# EasyEDA Pro project ProPrj_F411SoundBoard_2026-02-11.epro, board F411SoundBoard
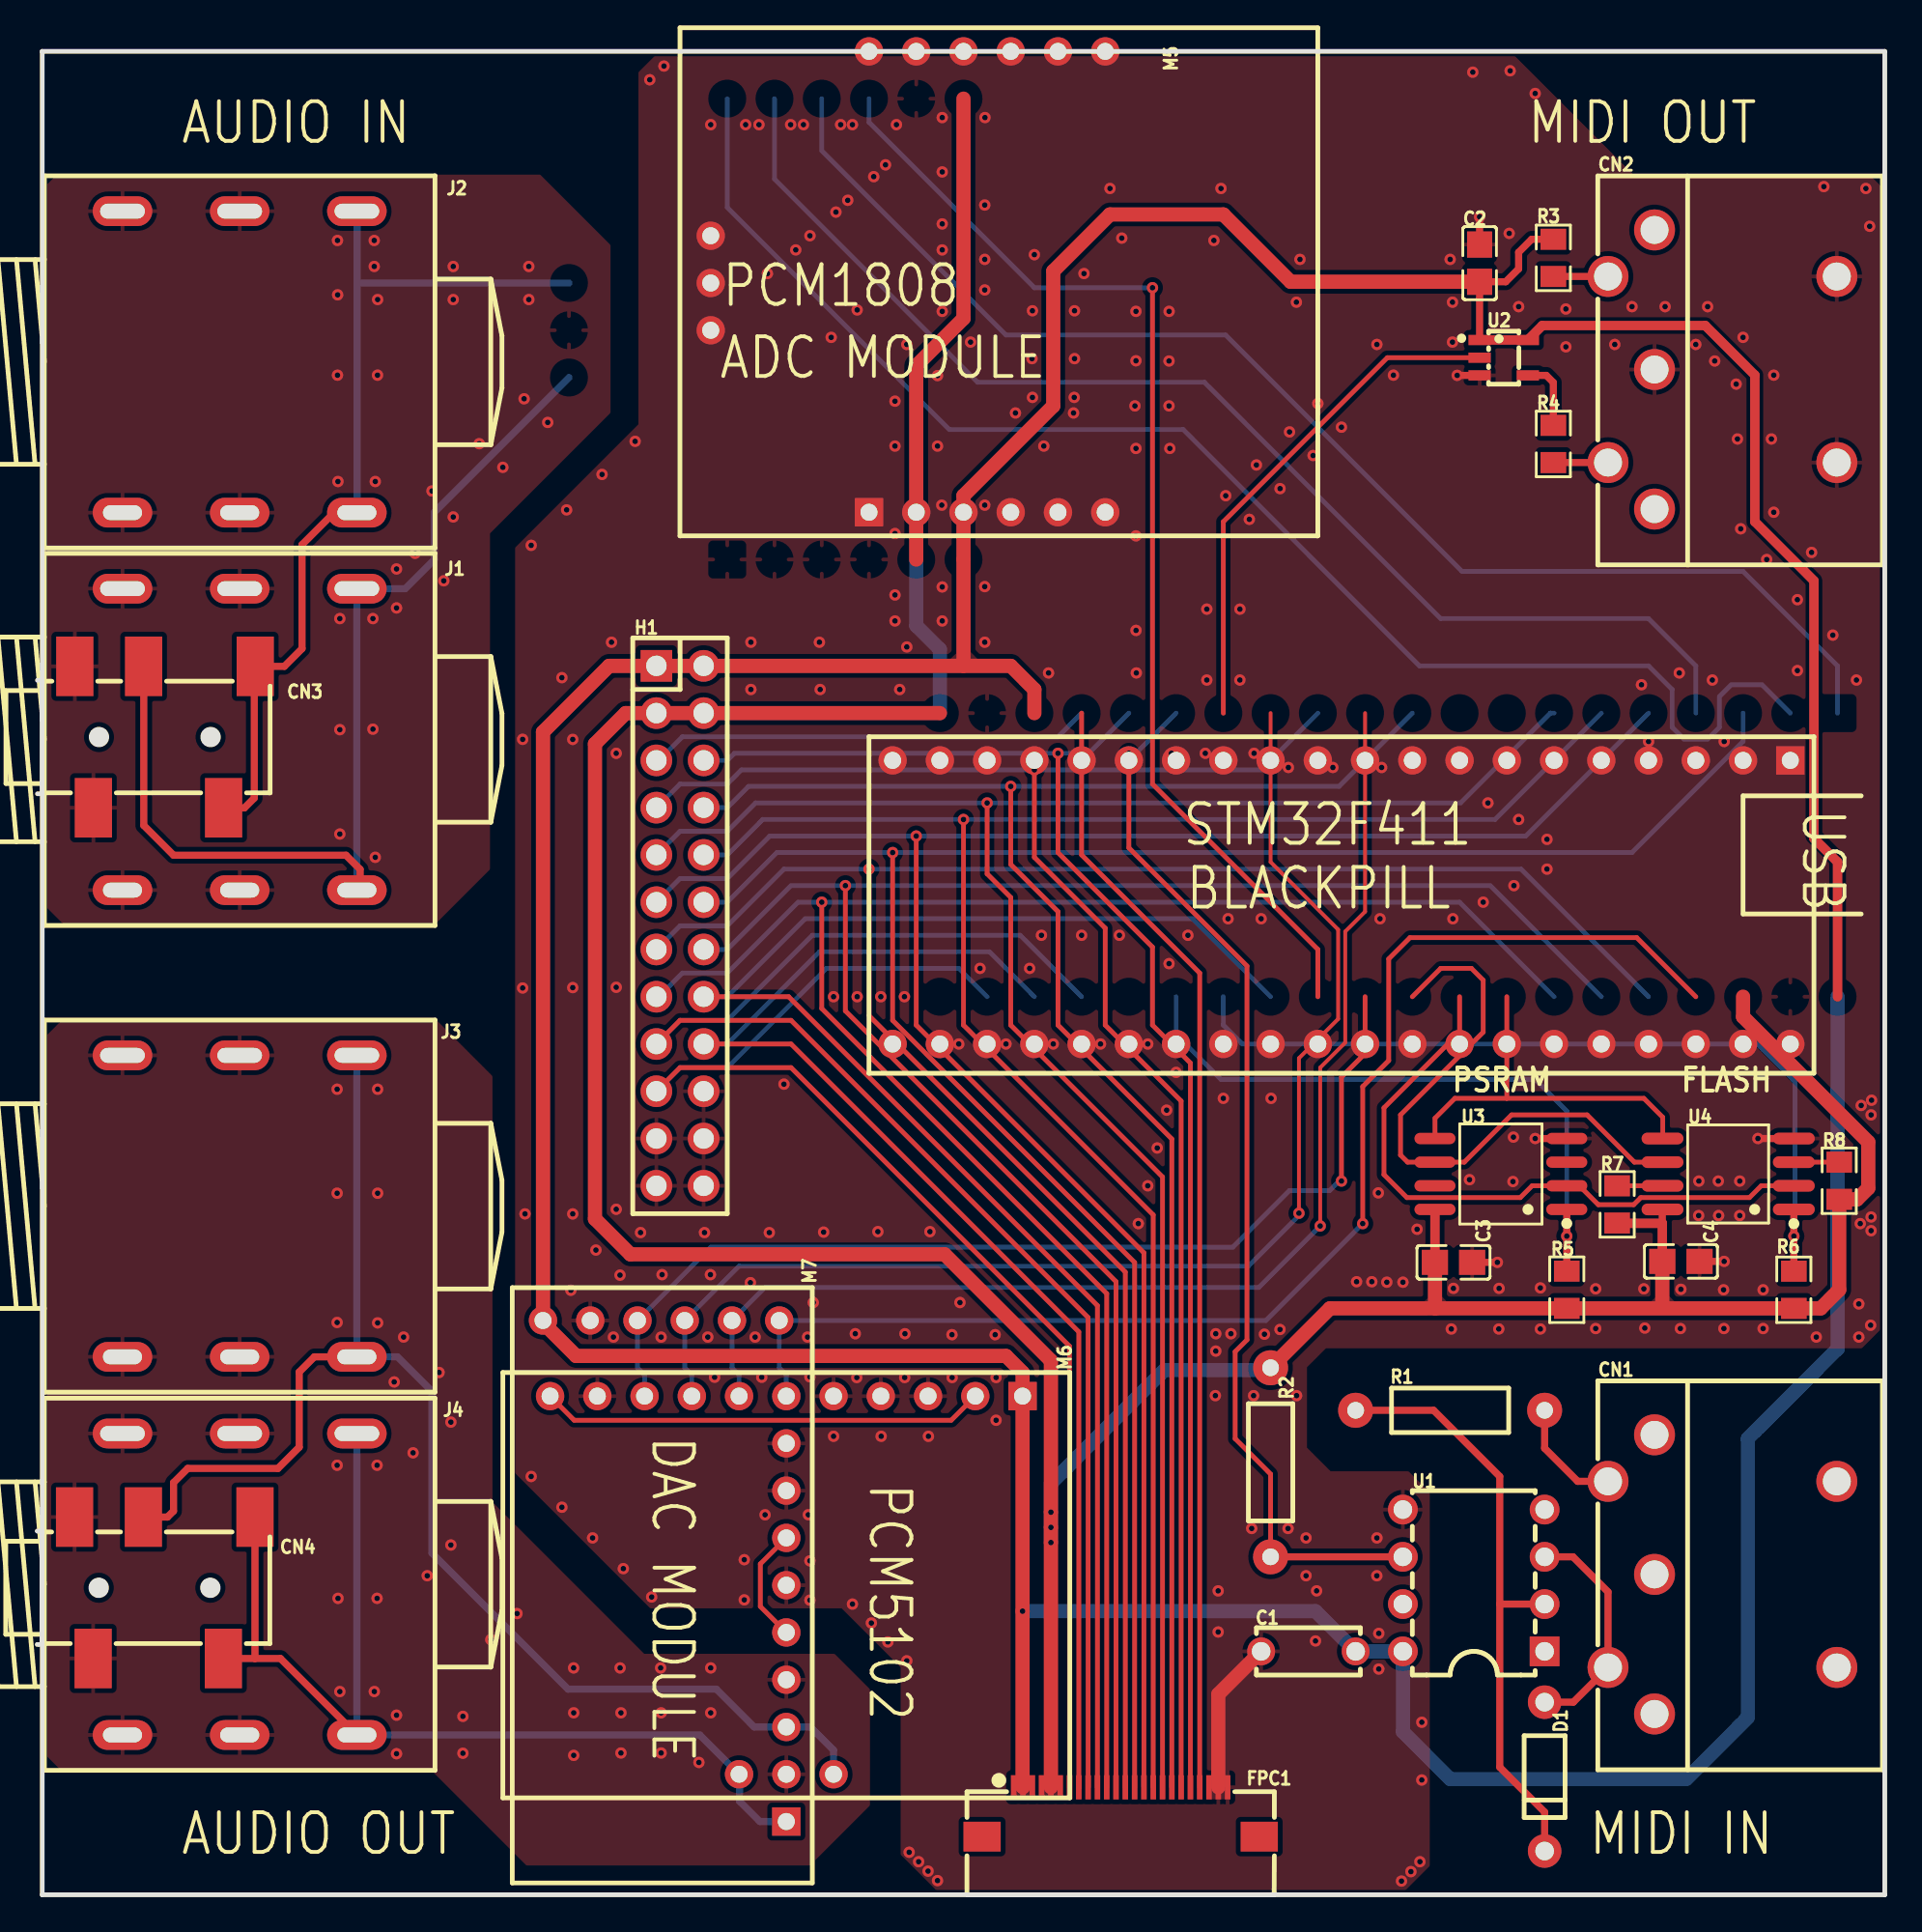
[diagram p2: board, top side]
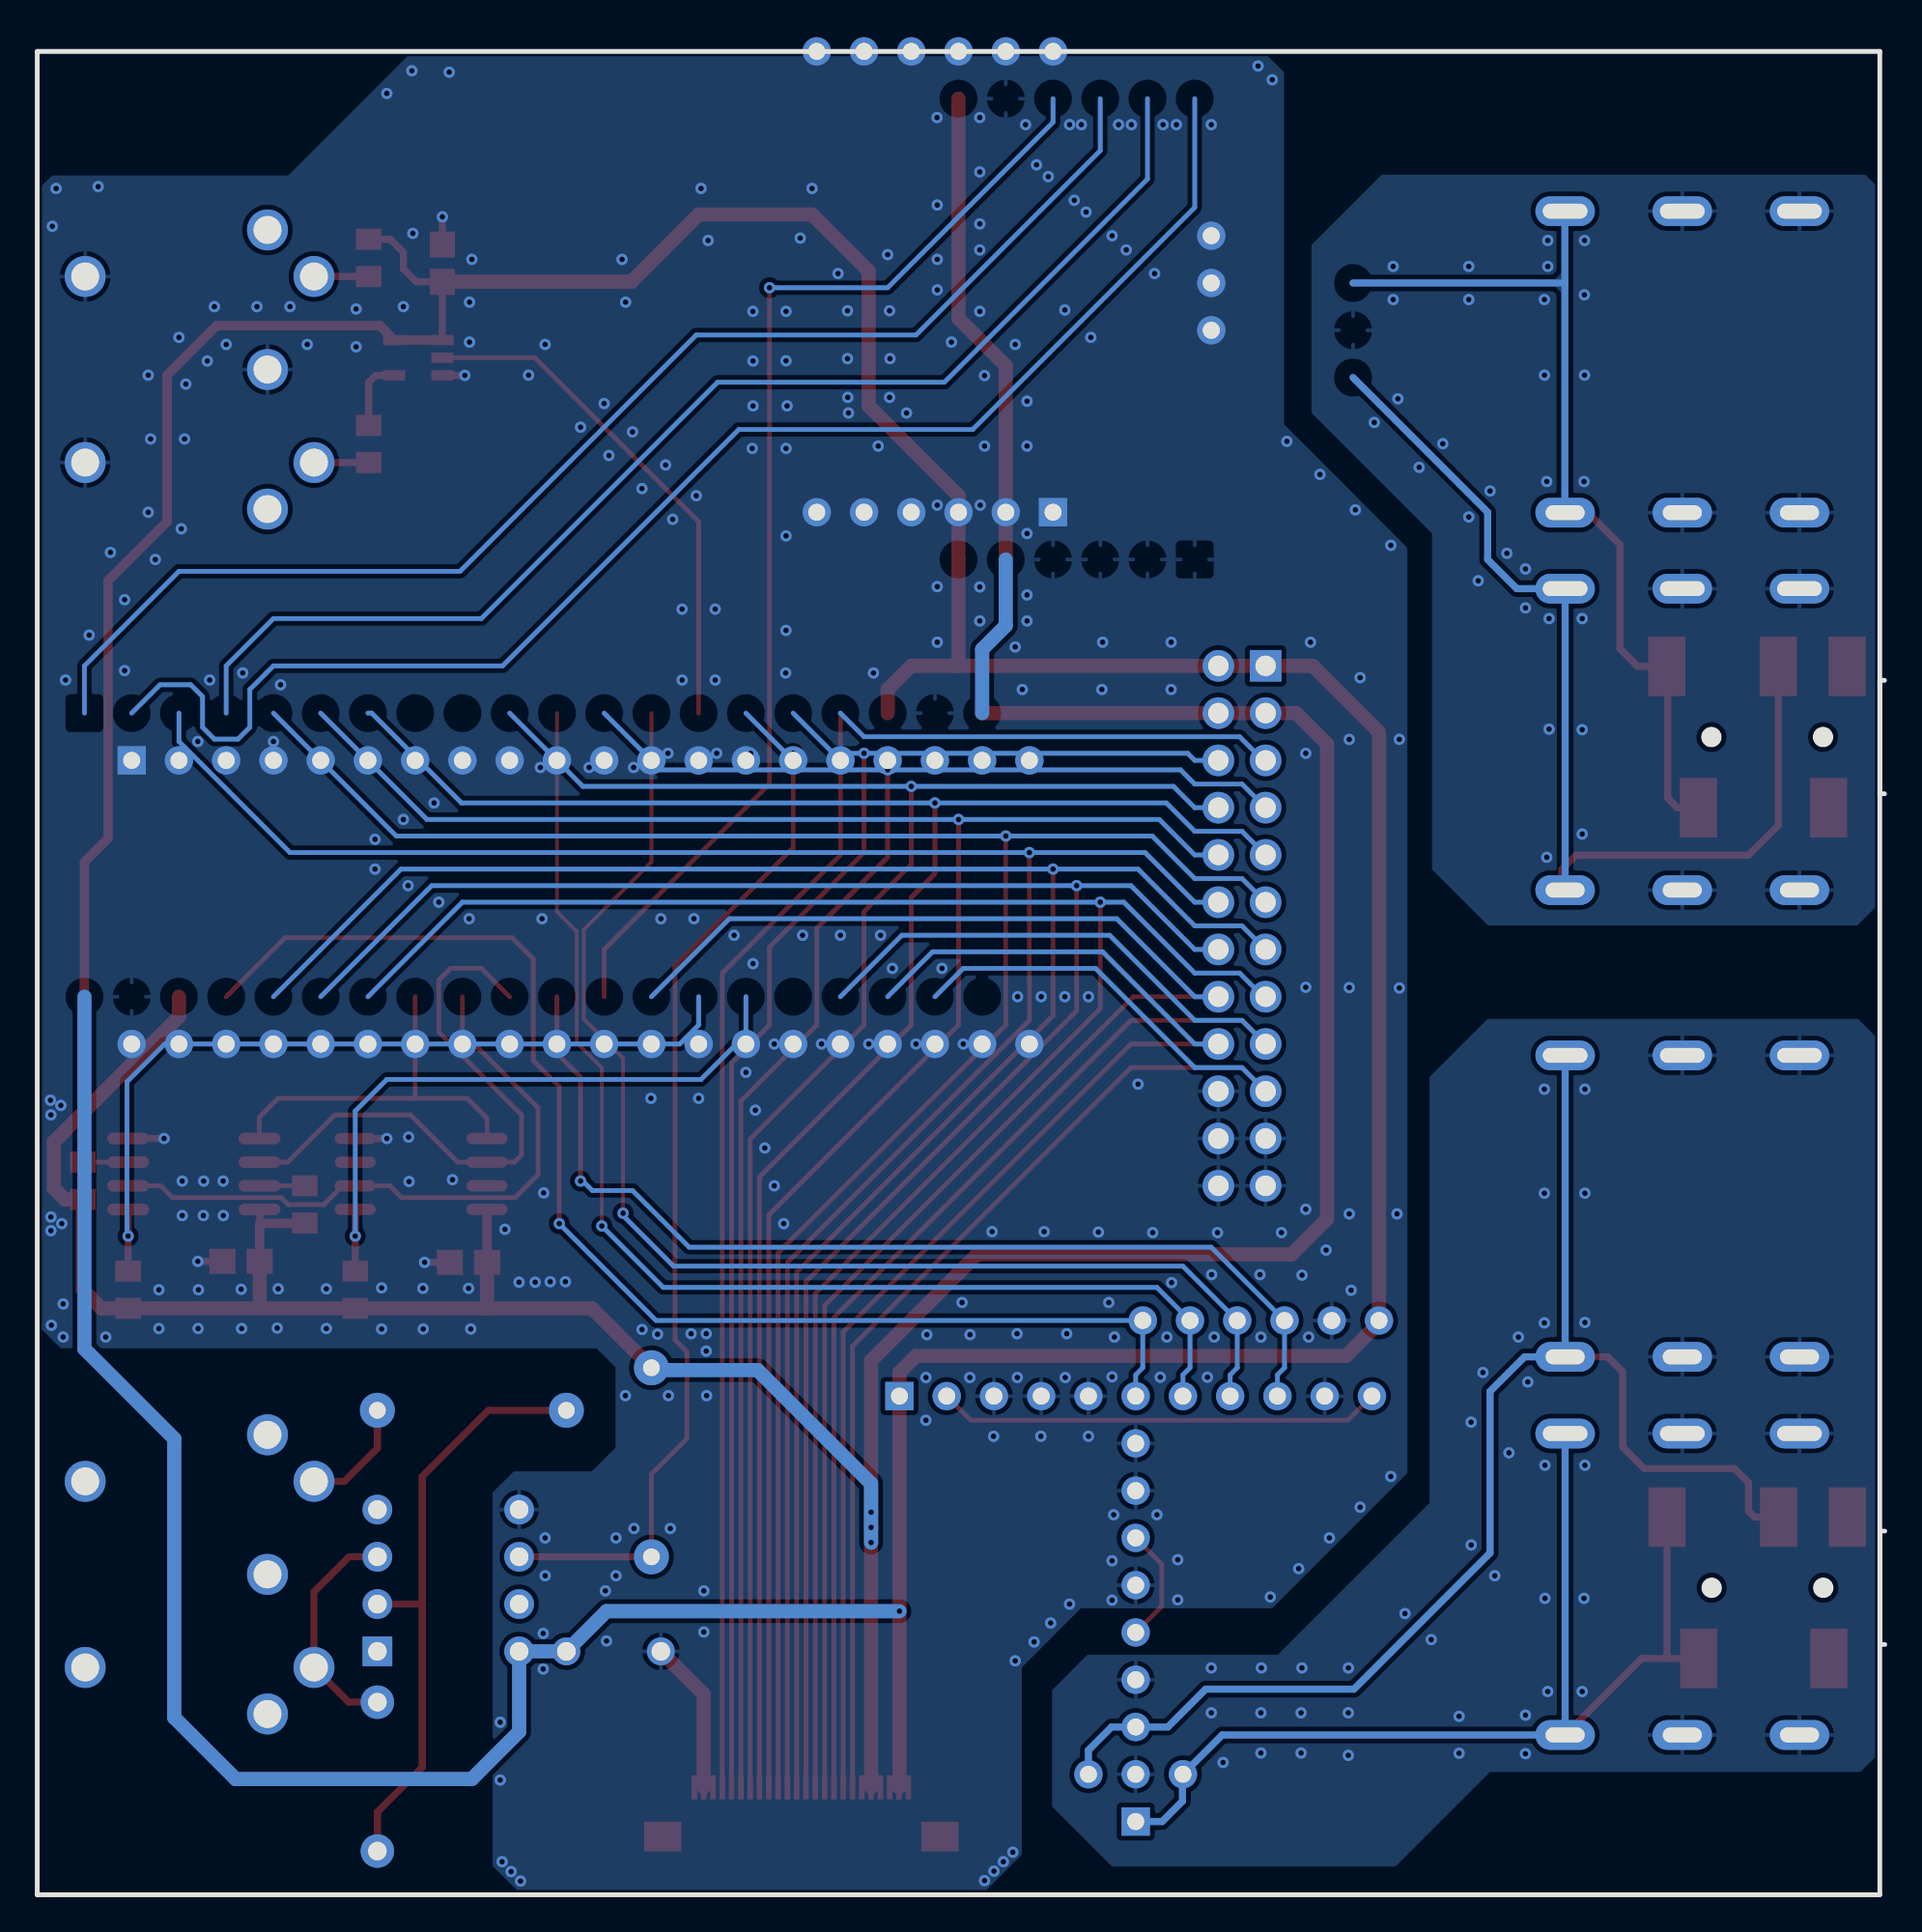
[diagram p3: board, bottom side, seen from below]

Outline 99.33 x 99.06 mm; copper layers: Top Layer, Bottom Layer. Coordinates in mm from the lower left corner of the outline.
Outline path: 0.27,99.06 99.33,99.06 99.33,0 0.27,0 0.27,99.06
Stack: Top Layer 0.035mm / Dielectric1 1.51mm FR4 er 4.5 / Bottom Layer 0.035mm

## Design rules (mm)
template: Custom Config
spacing copperThickness1oz (default): track to track 0.152, other pairs 0.152 to 0.3
spacing copperThickness2oz: track to track 0.203, other pairs 0.152 to 0.3
track width copperThickness1oz (default): min 0.127, default 0.254, max 2.54
track width copperThickness2oz: min 0.203, default 0.254, max 2.54
differential pair differentialPair (default): width min 0.127, default 0.254, max 2.54; gap min 0.152, default 0.152
via viaSize (default): diameter min 0.5, default 0.61, max 10; hole min 0.3, default 0.305, max 6.3

## Placement (name value [footprint] x y rotation side)
C1  100nF  [CAP-TH_L5.5-W2.4-P5.08-D0.6]  68.34 13.08 0 top
C2  100nF  [C0805]  77.54 87.68 90 top
C3  100nF  [C0805]  76.14 33.98 0 top
C4  100nF  [C0805]  88.37 34.04 0 top
CN1  DIN-504B-M10  [CONN-TH_DIN-504B-M10]  90.6 17.22 90 top
CN2  DIN-504B-M10  [CONN-TH_DIN-504B-M10]  90.6 81.97 90 top
CN3  PJ-327A 5JJ  [AUDIO-SMD_PJ-327A5JJ]  6.87 62.22 90 top
CN4  PJ-327A 5JJ  [AUDIO-SMD_PJ-327A5JJ]  6.86 16.5 90 top
D1  1N4148  [DO-35_BD2.0-L4.0-P8.00-D0.5-FD]  81.04 6.35 270 top
FPC1  AFC01-S24FCA-00  [FPC-SMD_24P-P0.50_AFC01-S24FCA-00]  58.25 4.45 0 top
H1  PZ254V-12-24P  [HDR-TH_24P-P2.54-V-M-R2-C12-S2.54]  34.56 52.07 270 top
J1  PJ-609  [AUDIO-TH_PJ-609]  10.89 62.09 0 top
J2  PJ-609  [AUDIO-TH_PJ-609]  10.89 82.37 0 top
J3  PJ-609  [AUDIO-TH_PJ-609]  10.89 37.01 0 top
J4  PJ-609  [AUDIO-TH_PJ-609]  10.89 16.69 0 top
M1  Blackpill F411  [Module_20x2_600mil]  96.79 63.5 270 top
M5  PCM1808  [PCM1808_ADC_MODULE]  37.1 71.75 90 top
M6  PCM5102  [WCMCU-5102]  52.97 26.8 270 top
M7  PCM5102  [PCM5102_MODULE]  40.27 3.94 180 top
R1  10kΩ  [R_AXIAL-0.4]  75.96 26.03 0 top
R2  10kΩ  [R_AXIAL-0.4]  66.31 23.24 90 top
R3  10kΩ  [R0805]  81.51 87.96 270 top
R4  10kΩ  [R0805]  81.51 77.96 270 top
R5  10kΩ  [R0805]  82.23 32.51 270 top
R6  10kΩ  [R0805]  94.44 32.51 270 top
R7  10kΩ  [R0805]  84.94 37.1 270 top
R8  10kΩ  [R0805]  96.88 38.37 270 top
U1  6N139  [DIP-8_L9.6-W6.4-P2.54-LS7.9-BL]  77.23 16.89 90 top
U2  74LVC1G126GV  [SOT-753_L3.1-W1.7-P0.95-LS3.0-BR]  78.84 82.6 180 top
U3  PSRAM 8MB  [SOP-8_L5.3-W5.2-P1.27-LS7.9-BL]  78.69 38.74 90 top
U4  W25Q128JVSIQ  [SOIC-8_L5.3-W5.3-P1.27-LS8.0-BL]  90.91 38.74 90 top

## Footprints (pads in the part's own frame, mm; a bottom-side part is the same pattern mirrored in y, then rotated)
AUDIO-SMD_PJ-327A5JJ
  rect 3.2x2 smd: 1(3.8,4.85) 2(-3.8,3.85) 3(3.8,1.15) 4(-3.8,-3.15) 5(3.8,-4.85)
AUDIO-TH_PJ-609
  oval 3.2x1.6 hole 2.1x0.8: 2(-6.3,-8.1) 4(0,-8.1) 6(6.3,-8.1)
  oval 3.2x1.6 hole 2.4x0.8: 3(-6.3,8.1) 5(0,8.1) 7(6.3,8.1)
C0805
  rect 1.41x1.35 smd: 1(-1,0) 2(1,0)
CAP-TH_L5.5-W2.4-P5.08-D0.6
  round 1.5 hole 1: 1(-2.54,0) 2(2.54,0)
CONN-TH_DIN-504B-M10
  round 2.2 hole 1.5: 1(-7.5,3.65) 2(-5,6.15) 3(0,3.65) 4(5,6.15) 5(7.5,3.65) 6(-5,-6.15) 7(5,-6.15)
DIP-8_L9.6-W6.4-P2.54-LS7.9-BL
  rect 1.6x1.6 hole 1: 1(-3.81,-3.81)
  round 1.6 hole 1: 2(-1.27,-3.81) 3(1.27,-3.81) 4(3.81,-3.81) 5(3.81,3.81) 6(1.27,3.81) 7(-1.27,3.81) 8(-3.81,3.81)
DO-35_BD2.0-L4.0-P8.00-D0.5-FD
  round 1.8 hole 1: 1(-4,0) 2(4,0)
FPC-SMD_24P-P0.50_AFC01-S24FCA-00
  rect 0.3x1.3 smd: 1(-5.75,1.325) 2(-5.25,1.325) 3(-4.75,1.325) 4(-4.25,1.325) 5(-3.75,1.325) 6(-3.25,1.325) 7(-2.75,1.325) 8(-2.25,1.325) 9(-1.75,1.325) 10(-1.25,1.325) 11(-0.75,1.325) 12(-0.25,1.325) 13(0.25,1.325) 14(0.75,1.325) 15(1.25,1.325) 16(1.75,1.325) 17(2.25,1.325) 18(2.75,1.325) 19(3.25,1.325) 20(3.75,1.325) 21(4.25,1.325) 22(4.75,1.325) 23(5.25,1.325) 24(5.75,1.325)
  rect 2x1.6 smd: 25(7.45,-1.325) 26(-7.45,-1.325)
HDR-TH_24P-P2.54-V-M-R2-C12-S2.54
  rect 1.7x1.7 hole 1.1: 1(-13.97,-1.27)
  round 1.7 hole 1.1: 2(-13.97,1.27) 3(-11.43,-1.27) 4(-11.43,1.27) 5(-8.89,-1.27) 6(-8.89,1.27) 7(-6.35,-1.27) 8(-6.35,1.27) 9(-3.81,-1.27) 10(-3.81,1.27) 11(-1.27,-1.27) 12(-1.27,1.27) 13(1.27,-1.27) 14(1.27,1.27) 15(3.81,-1.27) 16(3.81,1.27) 17(6.35,-1.27) 18(6.35,1.27) 19(8.89,-1.27) 20(8.89,1.27) 21(11.43,-1.27) 22(11.43,1.27) 23(13.97,-1.27) 24(13.97,1.27)
Module_20x2_600mil
  rect 1.524x1.524 hole 0.914: 1(2.54,-2.54)
  round 1.524 hole 0.914: 2(2.54,-5.08) 3(2.54,-7.62) 4(2.54,-10.16) 5(2.54,-12.7) 6(2.54,-15.24) 7(2.54,-17.78) 8(2.54,-20.32) 9(2.54,-22.86) 10(2.54,-25.4) 11(2.54,-27.94) 12(2.54,-30.48) 13(2.54,-33.02) 14(2.54,-35.56) 15(2.54,-38.1) 16(2.54,-40.64) 17(2.54,-43.18) 18(2.54,-45.72) 19(2.54,-48.26) 20(2.54,-50.8) 21(17.78,-50.8) 22(17.78,-48.26) 23(17.78,-45.72) 24(17.78,-43.18) 25(17.78,-40.64) 26(17.78,-38.1) 27(17.78,-35.56) 28(17.78,-33.02) 29(17.78,-30.48) 30(17.78,-27.94) 31(17.78,-25.4) 32(17.78,-22.86) 33(17.78,-20.32) 34(17.78,-17.78) 35(17.78,-15.24) 36(17.78,-12.7) 37(17.78,-10.16) 38(17.78,-7.62) 39(17.78,-5.08) 40(17.78,-2.54)
PCM1808_ADC_MODULE
  rect 1.524x1.524 hole 0.914: 1(2.54,-7.62)
  round 1.524 hole 0.914: 2(2.54,-10.16) 3(2.54,-12.7) 4(2.54,-15.24) 5(2.54,-17.78) 6(2.54,-20.32) 7(27.305,-20.32) 8(27.305,-17.78) 9(27.305,-15.24) 10(27.305,-12.7) 11(27.305,-10.16) 12(27.305,-7.62) 13(17.399,0.889) 14(14.859,0.889) 15(12.319,0.889)
PCM5102_MODULE
  rect 1.524x1.524 hole 0.914: 1(0,0)
  round 1.524 hole 0.914: 3(0,-5.08) 4(0,-7.62) 5(0,-10.16) 6(0,-12.7) 7(0,-15.24) 8(0,-17.78) 9(0,-20.32) 10(0.381,-26.924) 11(2.921,-26.924) 12(5.461,-26.924) 13(8.001,-26.924) 14(10.541,-26.924) 15(13.081,-26.924)
R0805
  rect 1.133x1.377 smd: 1(-1,0) 2(1,0)
R_AXIAL-0.4
  round 1.879 hole 0.899: 1(-5.08,0) 2(5.08,0)
SOIC-8_L5.3-W5.3-P1.27-LS8.0-BL
  oval 0.63x2.25 smd: 1(-1.905,-3.53) 2(-0.635,-3.53) 3(0.635,-3.53) 4(1.905,-3.53) 5(1.905,3.53) 6(0.635,3.53) 7(-0.635,3.53) 8(-1.905,3.53)
SOP-8_L5.3-W5.2-P1.27-LS7.9-BL
  oval 0.609x2.204 smd: 1(-1.905,-3.542) 2(-0.635,-3.542) 3(0.635,-3.542) 4(1.905,-3.542) 5(1.905,3.542) 6(0.635,3.542) 7(-0.635,3.542) 8(-1.905,3.542)
SOT-753_L3.1-W1.7-P0.95-LS3.0-BR
  rect 1.199x0.551 smd: 1(1.296,-0.95) 2(1.296,0) 3(1.296,0.95) 4(-1.296,0.95) 5(-1.296,-0.95)
WCMCU-5102
  rect 1.524x1.524 hole 0.914: 1(0,0)
  round 1.524 hole 0.914: 2(0,-2.54) 3(0,-5.08) 4(0,-7.62) 5(0,-10.16) 6(0,-12.7) 7(0,-15.24) 8(0,-17.78) 9(0,-20.32) 10(0,-22.86) 11(0,-25.4) 12(20.32,-15.24) 13(20.32,-12.7) 14(20.32,-10.16)

## Nets
As in the schematic.

Pads without a net: CN1 1 3 5 6 7; CN2 1 5; FPC1 25 26; M1 8 9 21 25; U1 1 4 7; U3 3 7

## Via types
v1: diameter 0.61, hole 0.305, Top Layer to Bottom Layer, 397 vias

## Routing (per net, layer and track width the routed paths; a pad name or vN(x,y) marks a point on that pad's centre or on a via; arc(x,y) is an arc through that point)
3V3: length 212.5
  Top Layer w0.381: 87.37,36.83 87.37,36.08
  Top Layer w0.508: U3.8 75.15,33.99 C3.1 ; 87.37,34.04 87.37,36.08 87.36,36.09 84.94,36.09
  Top Layer w0.762: 75.16,31.51 75.15,31.53 75.15,33.98 C3.1 ; 75.16,31.51 R5.2 R6.2 95.88,31.51 96.88,32.51 R8.2 97.84,37.37 98.44,37.97 98.44,40.45 91.71,47.18 91.71,48.26 ; 75.16,31.51 69.5,31.51 66.31,28.32 ; 48.53,63.5 H1.4 H1.3 31.64,63.5 29.99,61.85 29.99,36.32 31.89,34.42 48.78,34.42 54.5,28.7 v1(54.5,20.56) v1(54.5,19.74) v1(54.5,18.93) 54.5,5.78 ; 87.37,34.04 87.37,31.63 87.37,31.62 ; 47.26,71.75 47.26,82.17 49.8,84.71 49.8,96.52
  Bottom Layer w0.762: 54.5,18.92 v1(54.5,19.74) v1(54.5,20.56) 54.5,22.1 60.59,28.19 66.18,28.19 66.31,28.32 ; 48.53,63.5 48.53,66.93 47.26,68.2 47.26,71.75
+5V: length 306.9
  Top Layer w0.381: 77.54,83.55 C2.1 78.95,86.68 79.64,87.38 79.64,88.27 80.34,88.96 R3.1
  Top Layer w0.508: U2.1 U2.5 80.91,84.33 89.68,84.33 92.34,81.66 92.34,73.79 95.52,70.61 95.52,56.77 96.79,55.5 96.79,48.26
  Top Layer w0.762: FPC1.2 52.97,5.8 v1(52.97,15.24) M6.1 52.97,28.07 52.08,28.96 28.97,28.96 27.19,30.73 27.19,62.48 30.75,66.04 H1.1 H1.2 49.8,66.04 ; C2.1 67.38,86.68 63.77,90.3 57.67,90.3 54.62,87.25 54.62,80.01 49.8,75.18 49.8,66.04 ; 49.8,66.04 52.34,66.04 53.61,64.77 53.61,63.5
  Bottom Layer w0.762: v1(52.97,15.24) 68.72,15.24 C1.2 U1.8 73.42,8.76 75.96,6.22 88.66,6.22 91.96,9.53 91.96,24.51 96.79,29.34 96.79,48.26
GND: length 17.3
  Top Layer w0.381: C2.2 v1(77.54,90.17) ; U3.4 v1(80.53,40.64) ; C3.2 v1(78.5,33.98) ; U2.3 v1(76.34,81.65) ; C4.2 v1(90.69,34.04) ; U4.4 v1(92.51,40.64)
  Top Layer w0.762: C1.1 63.5,10.78 FPC1.23
  vias: v1(26.1,62.09) v1(26.1,48.73) v1(26.22,36.59) v1(26.56,72.52) v1(26.56,22.48) v1(28.21,65.41) v1(28.21,20.83) v1(28.46,74.42) v1(28.69,32.49) v1(28.79,62.09) v1(28.79,48.75) v1(28.79,36.59) v1(29.86,19.18) v1(30.04,34.65) v1(30.37,76.33) v1(30.88,67.31) v1(30.98,29.97) v1(31.13,61.34) v1(31.13,48.77) v1(31.13,36.84) v1(31.33,33.3) v1(31.51,17.53) v1(32.15,78.11) v1(32.44,35.59) v1(32.93,97.54) v1(33.03,16) v1(33.59,33.33) v1(33.54,29.97) v1(33.69,98.27) v1(35.87,35.59) v1(36.05,29.97) v1(36.21,95.12) v1(36.19,33.33) v1(36.42,27.81) v1(38.01,18.01) v1(38.01,15.85) v1(38.09,95.12) v1(38.37,67.31) v1(38.37,64.77) v1(38.34,32.89) v1(38.6,29.97) v1(38.8,95.12) v1(38.95,27.81) v1(39.13,20.42) v1(39.26,87.12) v1(39.36,35.59) v1(40.15,43.56) v1(40.5,95.12) v1(40.78,88.39) v1(41.2,95.12) v1(41.42,29.97) v1(41.46,20.42) v1(41.54,89.15) v1(41.54,27.83) v1(41.54,17.95) v1(41.54,15.83) v1(41.72,31.83) v1(42.05,67.31) v1(42.09,64.77) v1(42.28,35.61) v1(42.69,83.69) v1(42.81,48.26) v1(42.81,24.64) v1(42.94,90.42) v1(43.19,95.12) v1(43.57,91.06) v1(43.83,95.12) v1(43.83,15.62) v1(43.98,30.15) v1(44.08,85.17) v1(44.08,48.26) v1(44.06,27.8) v1(44.84,14.6) v1(44.97,92.33) v1(45.2,35.64) v1(45.35,48.26) v1(45.37,24.64) v1(45.61,92.96) v1(45.73,13.59) v1(46.12,80.26) v1(46.12,77.85) v1(46.12,73.15) v1(46.12,69.85) v1(46.12,68.45) v1(46.19,95.12) v1(46.37,64.77) v1(46.62,48.26) v1(46.65,30.15) v1(46.64,27.8) v1(46.75,83.31) v1(46.75,67.06) v1(46.75,12.57) v1(46.88,2.29) v1(47.38,1.78) v1(47.91,24.64) v1(47.89,1.27) v1(47.99,35.64) v1(48.4,81.64) v1(48.4,77.85) v1(48.4,0.76) v1(48.66,95.5) v1(48.66,92.58) v1(48.66,89.79) v1(48.66,88.39) v1(48.66,85.09) v1(48.63,74.68) v1(48.66,70.28) v1(48.66,68.45) v1(49.18,30.1) v1(49.19,27.8) v1(49.54,45.72) v1(49.61,31.83) v1(50.18,83.44) v1(50.69,49.78) v1(50.95,95.5) v1(50.94,90.81) v1(50.94,87.88) v1(50.94,86.24) v1(50.94,74.68) v1(50.94,70.3) v1(50.94,67.31) v1(51.5,30.1) v1(51.55,27.8) v1(51.55,25.5) v1(52.08,45.72) v1(52.59,79.63) v1(53.35,49.78) v1(53.51,85.12) v1(53.48,82.55) v1(53.51,80.47) v1(53.61,88.14) v1(53.99,51.56) v1(54.12,77.85) v1(54.37,65.66) v1(54.62,45.72) v1(55.71,79.63) v1(55.77,85.12) v1(55.77,82.55) v1(55.75,80.47) v1(56.15,51.56) v1(56.28,87.12) v1(57.16,45.72) v1(57.67,91.69) v1(58.18,51.56) v1(58.31,89.03) v1(59.01,80.01) v1(59.07,85.09) v1(59.07,82.44) v1(59.07,77.72) v1(59.07,73.03) v1(59.07,67.95) v1(59.09,65.66) v1(59.2,36.07) v1(59.7,45.72) v1(59.7,38.1) v1(60.21,40.13) v1(60.72,42.16) v1(60.85,85.09) v1(60.85,82.42) v1(60.85,80.01) v1(60.89,77.72) v1(60.85,50.04) v1(60.97,61.34) v1(61.23,44.2) v1(61.86,51.56) v1(62.8,61.34) v1(62.88,69.09) v1(62.88,65.28) v1(63.26,88.9) v1(63.36,30.15) v1(63.36,29.22) v1(63.34,26.82) v1(63.49,16.33) v1(63.49,14.12) v1(63.64,91.69) v1(63.77,42.8) v1(63.9,75.18) v1(64.02,52.45) v1(64.17,30.15) v1(64.66,69.09) v1(64.66,65.28) v1(65.16,73.91) v1(65.29,19.69) v1(65.4,26.82) v1(65.42,61.34) v1(65.55,76.84) v1(65.8,52.45) v1(65.98,30.12) v1(66.33,42.8) v1(66.82,75.56) v1(66.81,30.38) v1(67.26,60.58) v1(67.25,19.69) v1(67.32,78.61) v1(67.69,85.58) v1(67.71,26.82) v1(67.89,87.88) v1(68.21,19.18) v1(68.21,17.15) v1(68.59,77.34) v1(68.78,16.33) v1(68.72,13.64) v1(68.85,80.14) v1(69.66,60.58) v1(70.12,78.87) v1(70.93,32.94) v1(71.75,32.94) v1(72.02,83.31) v1(72.1,37.72) v1(72.02,19.18) v1(72.02,17.15) v1(72.19,52.45) v1(72.12,14.05) v1(72.12,12.13) v1(72.28,60.58) v1(72.56,32.92) v1(72.91,81.66) v1(73.34,0.74) v1(73.42,32.92) v1(73.85,1.24) v1(74.18,35.76) v1(74.33,1.78) v1(74.44,9.27) v1(74.44,6.17) v1(75.96,87.88) v1(76.09,85.58) v1(76.09,83.44) v1(76.11,52.45) v1(76.02,30.4) v1(76.14,32.59) v1(77,38.43) v1(77.18,97.94) v1(77.74,53.34) v1(77.99,58.67) v1(78.59,32.59) v1(78.58,30.4) v1(79.19,98.02) v1(79.13,89.28) v1(79.39,54.23) v1(79.36,40.72) v1(79.34,38.33) v1(79.64,85.34) v1(79.64,57.78) v1(80.53,96.8) v1(80.81,32.61) v1(80.81,30.4) v1(81.17,56.72) v1(81.17,55.12) v1(82.18,85.22) v1(82.18,83.19) v1(83.78,32.56) v1(83.78,30.43) v1(84.81,83.31) v1(85.74,85.34) v1(86.25,65.02) v1(86.37,32.56) v1(86.43,30.45) v1(86.63,61.98) v1(87.52,85.34) v1(88.28,65.66) v1(88.36,32.54) v1(88.34,30.43) v1(89.17,83.31) v1(89.33,38.35) v1(89.32,36.5) v1(89.8,85.34) v1(90.06,65.28) v1(90.18,82.42) v1(90.38,38.35) v1(90.39,36.5) v1(90.69,61.98) v1(90.66,32.51) v1(90.68,30.43) v1(91.34,81.18) v1(91.41,78.23) v1(91.58,73.41) v1(91.53,38.35) v1(91.53,36.5) v1(91.71,83.69) v1(92.79,32.51) v1(92.79,30.43) v1(92.98,71.75) v1(93.23,78.23) v1(93.36,81.66) v1(93.36,74.3) v1(94.63,69.6) v1(94.63,65.79) v1(95.39,72.14) v1(95.65,29.97) v1(96.05,91.8) v1(96.53,67.69) v1(97.8,65.28) v1(98.01,36.07) v1(97.93,31.75) v1(97.93,29.97) v1(98.06,42.42) v1(98.31,91.69) v1(98.52,89.66) v1(98.62,42.7) v1(98.59,41.91) v1(98.59,36.42) v1(98.59,35.69) v1(98.57,30.61)
AIGND:
  vias: v1(16.14,88.9) v1(16.15,85.98) v1(16.14,81.66) v1(16.17,75.95) v1(16.27,68.58) v1(16.27,62.61) v1(16.27,57) v1(18.05,68.58) v1(18.05,62.64) v1(18.12,88.9) v1(18.12,87.5) v1(18.17,75.95) v1(18.17,55.75) v1(18.3,85.73) v1(18.3,81.66) v1(19.32,71.25) v1(19.32,69.15) v1(20.32,72.09) v1(21.22,75.44) v1(21.86,70.61) v1(22.37,87.5) v1(22.37,85.73) v1(22.37,74.04) v1(23.76,77.98) v1(25.03,76.71) v1(26.18,80.39) v1(26.43,87.5) v1(26.43,85.73) v1(27.45,79.12)
AOGND:
  vias: v1(16.12,43.29) v1(16.12,37.7) v1(16.12,30.75) v1(16.12,23.08) v1(16.17,15.93) v1(16.27,10.92) v1(18.12,10.92) v1(18.3,43.29) v1(18.3,37.7) v1(18.3,30.73) v1(18.27,23.08) v1(18.27,15.93) v1(19.19,27.56) v1(19.32,9.65) v1(19.32,7.58) v1(19.7,29.97) v1(20.21,23.75) v1(20.97,17.15) v1(21.6,28.07) v1(22.24,25.4) v1(22.24,18.8) v1(22.89,9.59) v1(22.89,7.6) v1(24.39,13.71) v1(25.8,15.11) v1(28.84,12.19) v1(28.84,9.78) v1(28.84,7.49) v1(31.34,12.19) v1(31.38,9.78) v1(31.38,7.62) v1(33.52,12.19) v1(33.54,9.78) v1(33.54,7.62) v1(35.57,7.11) v1(36.21,12.19) v1(36.21,9.78)
AOL: length 58.5
  Top Layer w0.381: 11.7,12.7 CN4.4 ; 11.7,12.7 13.08,12.7 J4.6 ; 11.7,12.7 11.71,12.7 CN4.5
  Bottom Layer w0.381: J4.7 J4.6 35.62,8.59 M6.12 37.76,6.45 37.76,5.03 38.85,3.94 M7.1
AOR: length 75.3
  Top Layer w0.381: CN4.3 7,20.3 7.33,20.62 7.33,22.15 8.09,22.91 12.94,22.91 14.09,24.05 14.09,28.09 14.9,28.91 J3.6
  Bottom Layer w0.381: J3.7 J3.6 19.37,28.91 21.22,27.05 21.22,18.36 28.54,11.05 36.51,11.05 38.55,9.02 41.57,9.02 42.81,7.77 42.81,6.48
FLASH_CE: length 45.1
  Top Layer w0.381: U4.1 v1(94.44,35.39) R6.1
  Bottom Layer w0.254: 94.46,35.39 94.5,35.43 94.5,43.69 92.47,45.72 64.78,45.72 63.77,46.74 63.77,48.26
GPIO1: length 84.3
  Top Layer w0.254: 56.15,63.5 56.15,55.88 62.5,49.53 FPC1.21
  Bottom Layer w0.254: H1.5 33.41,60.96 34.69,62.23 54.88,62.23 56.15,63.5
GPIO2: length 82.4
  Top Layer w0.254: FPC1.20 62,44.7 59.96,46.74 59.96,50.93 54.88,56.01 v1(54.88,61.34)
  Bottom Layer w0.254: H1.6 37.1,60.96 37.48,61.34 v1(54.88,61.34) 56.53,61.34 58.69,63.5
GPIO3: length 95.6
  Top Layer w0.254: v1(53.61,60.45) 53.61,55.75 57.42,51.94 57.42,46.74 61.5,42.66 FPC1.19
  Bottom Layer w0.254: 68.85,63.5 65.8,60.45 v1(53.61,60.45) 37.86,60.45 37.1,59.69 34.56,59.69 H1.7
GPIO4: length 97.6
  Top Layer w0.254: v1(52.34,59.56) 52.34,55.37 54.88,52.83 54.88,46.74 61,40.62 FPC1.18
  Bottom Layer w0.254: 73.93,63.5 69.99,59.56 v1(52.34,59.56) 38.24,59.56 37.1,58.42 H1.8
GPIO5: length 108.2
  Top Layer w0.254: FPC1.17 60.5,38.58 52.34,46.74 52.34,53.59 51.07,54.86 v1(51.07,58.67)
  Bottom Layer w0.254: 81.55,63.5 81.34,63.5 76.52,58.67 v1(51.07,58.67) 38.62,58.67 37.1,57.15 34.56,57.15 H1.9
GPIO6: length 107.7
  Top Layer w0.254: FPC1.16 60,36.54 49.8,46.74 v1(49.8,57.78)
  Bottom Layer w0.254: 84.09,63.5 78.37,57.78 v1(49.8,57.78) 39,57.78 37.1,55.88 H1.10
GPIO7: length 113.7
  Top Layer w0.254: v1(47.26,56.9) 47.26,46.74 59.5,34.5 FPC1.15
  Bottom Layer w0.254: H1.11 34.56,54.61 37.1,54.61 39.38,56.9 v1(47.26,56.9) 80.02,56.9 86.63,63.5
GPIO8: length 116.6
  Top Layer w0.254: v1(45.99,56.01) 45.99,46.99 59,33.98 FPC1.14
  Bottom Layer w0.254: 91.71,63.5 91.71,61.98 85.74,56.01 v1(45.99,56.01) 39.77,56.01 37.1,53.34 H1.12
GPIO9: length 113
  Top Layer w0.254: FPC1.13 58.5,33.46 44.72,47.24 v1(44.72,55.12)
  Bottom Layer w0.254: 86.63,48.26 79.77,55.12 v1(44.72,55.12) 40.15,55.12 37.1,52.07 34.56,52.07 H1.13
GPIO10: length 106.6
  Top Layer w0.254: FPC1.12 58,32.95 43.45,47.5 v1(43.45,54.23)
  Bottom Layer w0.254: H1.14 37.1,50.8 40.53,54.23 v1(43.45,54.23) 78.12,54.23 84.09,48.26
GPIO11: length 106.4
  Top Layer w0.254: v1(42.18,53.34) 42.18,47.62 57.5,32.31 FPC1.11
  Bottom Layer w0.254: 81.55,48.26 76.47,53.34 v1(42.18,53.34) 40.91,53.34 37.1,49.53 34.69,49.53 33.41,48.26 H1.15
GPIO12: length 87.9
  Top Layer w0.254: H1.16 40.4,48.26 57,31.66 FPC1.10
  Bottom Layer w0.254: 66.31,48.26 62.12,52.45 41.29,52.45 37.1,48.26 H1.16
GPIO13: length 82.2
  Top Layer w0.254: FPC1.9 56.5,31.02 40.53,46.99 34.56,46.99 H1.17
  Bottom Layer w0.254: 56.15,48.26 52.85,51.56 41.67,51.56 37.1,46.99 34.56,46.99 H1.17
GPIO14: length 71.9
  Top Layer w0.254: H1.18 40.53,45.72 56,30.25 FPC1.8
  Bottom Layer w0.254: H1.18 37.1,45.72 42.05,50.67 51.19,50.67 53.61,48.26
GPIO15: length 73.8
  Top Layer w0.254: FPC1.7 55.5,29.48 40.53,44.45 34.56,44.45 H1.19
  Bottom Layer w0.254: H1.19 34.56,44.45 37.1,44.45 42.43,49.78 49.54,49.78 51.07,48.26
I2S2_BCK: length 78.8
  Bottom Layer w0.254: 37.1,96.52 37.1,90.68 49.04,78.74 61.61,78.74 74.31,66.04 86.63,66.04 87.9,64.77 87.9,62.74 88.53,62.1 89.8,62.1 90.44,62.74 90.44,64.39 91.07,65.02 92.72,65.02 94.25,63.5
I2S2_LRCK: length 71.4
  Bottom Layer w0.254: 96.79,63.5 96.79,66.04 91.71,71.12 76.59,71.12 63.9,83.82 52.08,83.82 42.18,93.73 42.18,96.52
I2S2_SCK: length 62
  Top Layer w0.254: v1(59.96,86.36) 59.96,59.69 68.85,50.8 68.85,48.26
  Bottom Layer w0.254: 44.72,96.52 44.72,95.25 53.61,86.36 v1(59.96,86.36)
I2S2_SD: length 67.2
  Bottom Layer w0.254: 39.64,96.52 39.64,92.2 50.56,81.28 62.75,81.28 75.45,68.58 86.63,68.58 89.17,66.04 89.17,63.5
I2S3_BCK: length 66.5
  Top Layer w0.203: v1(68.97,35.94) 68.97,44.45 70.32,45.8 70.32,51.77 71.39,52.83 71.39,63.5
  Bottom Layer w0.254: M6.7 37.73,27.94 37.35,28.32 37.35,30.86 39.13,32.64 65.67,32.64 v1(68.97,35.94)
I2S3_LRCK: length 55.6
  Top Layer w0.254: 71.39,48.26 71.39,45.21 70.12,43.94 v1(70.12,38.35)
  Bottom Layer w0.254: 32.65,26.8 32.65,27.94 32.27,28.32 32.27,30.86 36.21,34.8 64.28,34.8 67.32,37.85 69.48,37.85 69.99,38.35 v1(70.12,38.35)
I2S3_SCK: length 70.8
  Top Layer w0.254: 89.17,48.26 85.99,51.44 73.8,51.44 72.66,50.29 72.66,44.83 71.26,43.43 v1(71.26,36.07)
  Bottom Layer w0.254: v1(71.26,36.07) 66.05,30.86 39.89,30.86 39.89,28.32 40.27,27.94 40.27,26.8
I2S3_SD: length 69
  Top Layer w0.203: v1(67.83,36.63) 67.83,44.96 69.94,47.07 69.94,51.87 66.31,55.5 66.31,63.5
  Bottom Layer w0.254: M6.8 35.19,27.94 34.81,28.32 34.81,30.86 37.73,33.78 65.11,33.78 67.83,36.5 v1(67.83,36.63)
MIDI_RX: length 57.4
  Top Layer w0.254: R2.1 66.31,22.61 64.4,24.51 64.4,29.18 65.04,29.82 65.04,49.91 58.69,56.26 v1(58.69,61.34)
  Top Layer w0.381: U1.6 R2.1
  Bottom Layer w0.254: v1(58.69,61.34) 59.07,61.34 61.23,63.5
MIDI_TX: length 27.7
  Top Layer w0.254: 63.77,63.5 63.77,73.79 72.58,82.6 U2.2
PSRAM_CE: length 34.8
  Top Layer w0.381: R5.1 82.23,36.83
  Bottom Layer w0.254: 61.23,48.26 61.23,46.23 63.64,43.81 80.53,43.81 82.23,42.12 v1(82.23,35.39)
SPI1_MISO: length 34.9
  Top Layer w0.254: 94.45,38.1 92.69,38.1 92.05,37.47 86.21,37.47 85.83,37.09 83.92,37.09 82.91,38.1 U3.2 80.37,38.1 79.73,37.47 73.64,37.47 72.4,38.7 72.4,42.29 76.47,46.36 76.47,48.26
SPI1_MOSI: length 20.8
  Top Layer w0.254: U4.5 87.39,40.65 87.39,41.78 86.37,42.8 79,42.8 ; 79,42.8 76.21,42.8 75.15,41.73 U3.5 ; 79,42.8 79.01,42.81 79.01,48.26
SPI1_SCK: length 32.3
  Top Layer w0.254: 73.93,48.26 75.45,49.78 77.1,49.78 77.74,49.15 77.74,46.36 73.29,41.91 73.29,39.75 73.67,39.37 U3.6 76.72,39.37 79.26,41.91 83.33,41.91 85.87,39.37 U4.6
$1N8448: length 32.8
  Top Layer w0.381: U1.2 78.63,15.62 78.63,15.62 ; 78.63,15.62 78.63,6.86 81.04,4.44 D1.2 ; 78.63,15.62 78.63,22.48 75.07,26.03 R1.1
$1N8617: length 4.2
  Top Layer w0.381: 81.51,78.65 81.51,81.27 81.13,81.65 U2.4
$1N9304: length 6.2
  Top Layer w0.381: R1.2 81.04,24 82.82,22.22 CN1.4
$1N9313: length 12.4
  Top Layer w0.381: D1.1 82.58,10.35 CN1.2 84.45,16.28 82.56,18.16 U1.3
$1N9335: length 2.9
  Top Layer w0.381: CN2.4 81.51,86.97
$1N9340: length 2.9
  Top Layer w0.381: CN2.2 81.51,76.97
$1N10058: length 23.9
  Top Layer w0.254: 50.43,26.8 49.14,25.5 28.87,25.5 M6.11
$1N10064: length 6.2
  Top Layer w0.254: 40.27,19.18 38.88,17.78 38.88,15.49 M7.5
$1N10608: length 56.1
  Top Layer w0.381: CN3.3 5.73,66.01 5.73,57.46 7.33,55.87 16.6,55.87 17.36,55.1 17.36,54.17 17.18,53.99
  Bottom Layer w0.381: 17.18,53.99 17.18,70.19 ; J1.7 19.78,70.19 21.35,71.75 21.35,74.3 28.59,81.53
$1N10635: length 49.6
  Top Layer w0.381: 17.96,74.27 15.96,74.27 14.24,72.55 14.24,66.97 13.29,66.02 11.67,66.02 11.67,58.94 11.14,58.41 9.98,58.41 9.97,58.42
  Bottom Layer w0.381: 17.2,90.47 17.2,86.61 ; 17.2,86.61 17.2,74.27 ; 17.2,86.61 28.59,86.61
$1N21996: length 2.4
  Top Layer w0.254: R8.1 94.45,39.37
$1N22001: length 2.4
  Top Layer w0.254: R7.1 87.37,38.1

## Copper pours and planes (outline as drawn; the poured copper is in the pictures)
3V3 on Top Layer: 86.03,32.51 88.7,32.51 88.7,31.18 86.03,31.18
3V3 on Top Layer: 53.99,6.32 55.01,6.32 55.01,5.13 53.99,5.13
3V3 on Top Layer: 73.81,32.48 76.48,32.48 76.48,31.16 73.81,31.16
+5V on Top Layer: 48.46,67.13 51.13,67.13 51.13,65.81 48.46,65.81
+5V on Top Layer: 52.47,6.22 53.49,6.22 53.49,5.13 52.47,5.13
GND on Top Layer: 33.47,99.09 32.32,97.94 32.32,79.02 25.69,72.39 25.69,22.66 32.96,15.39 43.24,15.39 46.42,12.22 46.42,2.16 48.55,0.03 73.34,0.03 74.87,1.55 74.87,21.62 73.72,22.76 69.53,22.76 68.26,24.03 68.26,28.35 69.28,29.36 98.09,29.36 99.38,30.65 99.38,91.56 98.55,92.39 85.86,92.39 79.17,99.09
GND on Top Layer: 62.99,6.32 64.01,6.32 64.01,5.13 62.99,5.13
GND on Bottom Layer: 33.44,99.09 32.3,97.94 32.3,79.02 25.67,72.39 25.67,22.66 32.93,15.39 43.22,15.39 46.39,12.22 46.39,2.16 48.52,0.03 73.32,0.03 74.84,1.55 74.84,21.62 73.7,22.76 69.51,22.76 68.24,24.03 68.24,28.35 69.25,29.36 98.07,29.36 99.35,30.65 99.35,91.56 98.53,92.39 85.84,92.39 79.14,99.09
AIGND on Top Layer: 30.82,79.64 30.82,88.66 27.04,92.44 1.05,92.44 0.43,91.82 0.43,53.13 1.47,52.09 21.33,52.09 24.35,55.1 24.35,73.16
AIGND on Bottom Layer: 30.82,79.64 30.82,88.66 27.04,92.44 1.05,92.44 0.43,91.82 0.43,53.13 1.47,52.09 21.33,52.09 24.35,55.1 24.35,73.16
AOGND on Top Layer: 32.63,12.95 24.47,21.1 24.47,44 21.36,47.11 1.44,47.11 0.39,46.07 0.39,7.57 1.31,6.65 21.22,6.65 26.3,1.57 41.54,1.57 44.77,4.8 44.77,11.05 42.86,12.95
AOGND on Bottom Layer: 32.63,12.9 24.47,21.06 24.47,43.95 21.36,47.06 1.44,47.06 0.39,46.03 0.39,7.52 1.31,6.6 21.22,6.6 26.3,1.52 41.54,1.52 44.77,4.75 44.77,11 42.86,12.9
$1N10635 on Bottom Layer: 17.2,87.35 17.92,87.35 17.92,85.91 17.2,85.91

## Text on the board
Top Silkscreen Layer: PSRAM | FLASH | AUDIO IN | AUDIO OUT | ADC MODULE | PCM1808 | STM32F411 | BLACKPILL | MIDI OUT | MIDI IN | DAC MODULE | PCM5102 | USB
